# EAGLE design PhotoSensor (EAGLE 7.5.0)
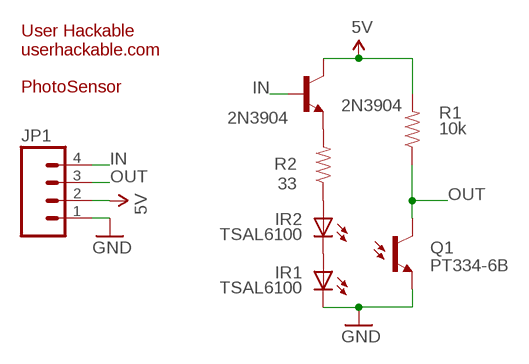
[diagram p0: schematic, sheet 1]

## Parts
2N3904  2N3904  TRANSISTOR_NPNTO-92-AMMO  [TO-92-AMMO]
IR1  TSAL6100  LED5MM  [LED5MM]
IR2  TSAL6100  LED5MM  [LED5MM]
JP1  M04PTH  [1X04]
Q1  PT334-6B  PHOTOTRANSISTOR5MM  [LED5MM]
R1  10k  RESISTORAXIAL-0.3  [AXIAL-0.3]
R2  33  RESISTORAXIAL-0.3  [AXIAL-0.3]

## Nets
5V: 2N3904.3(C) JP1.2 R1.P$2
GND: IR1.K(C) JP1.1 Q1.A(E)
IN: 2N3904.2(B) JP1.4
N$1: IR1.A IR2.K(C)
N$3: IR2.A R2.P$1
N$4: 2N3904.1(E) R2.P$2
OUT: JP1.3 Q1.K(C) R1.P$1

## Notes on the sheet
- User Hackable
  userhackable.com
  
  PhotoSensor

## Library data of the parts
2N3904 = barbary_enterprises:TRANSISTOR_NPN: Generic NPN BJT MMBT2222A - TRANS-08049 (SOT-23, 1A 40V) MPSA42 - TRANS-09116 (SOT-23, 500mA 300V) MMBT5088LT1G - TRANS-11160 (SOT-23, 50 mA 30V)
IR1 IR2 = Optics:LED: LEDs Standard schematic elements and footprints for 5mm, 3mm, 1206, and 0603 sized LEDs. 5mm - Spark Fun Electronics SKU : COM-00529 (and others)
JP1 = barbary_enterprises:M04: Header 4 Standard 4-pin 0.1" header. Use with straight break away headers (SKU : PRT-00116), right angle break away headers (PRT-00553), swiss pins (PRT-00743), machine pins (PRT-00117), and female headers (PRT-00115). Molex polarized connector foot print use with SKU : PRT-08231 with associated crimp pins and housings. 1MM SMD Version SKU: PRT-10208
Q1 = Optics:PHOTOTRANSISTOR
R1 R2 = barbary_enterprises:RESISTOR: Resistor Basic schematic elements and footprints for 0603, 1206, and PTH resistors.

## Board
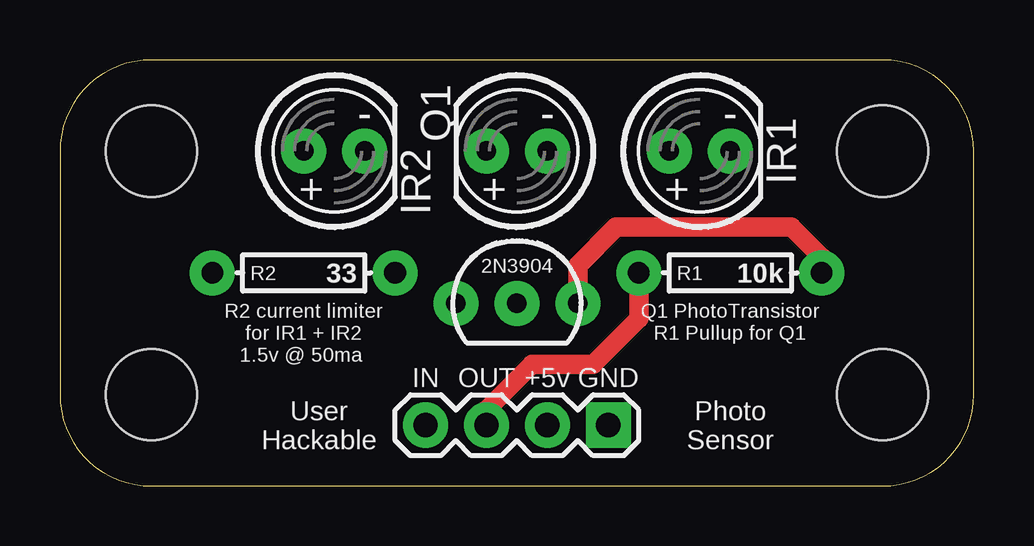
[diagram p1: board, top side]
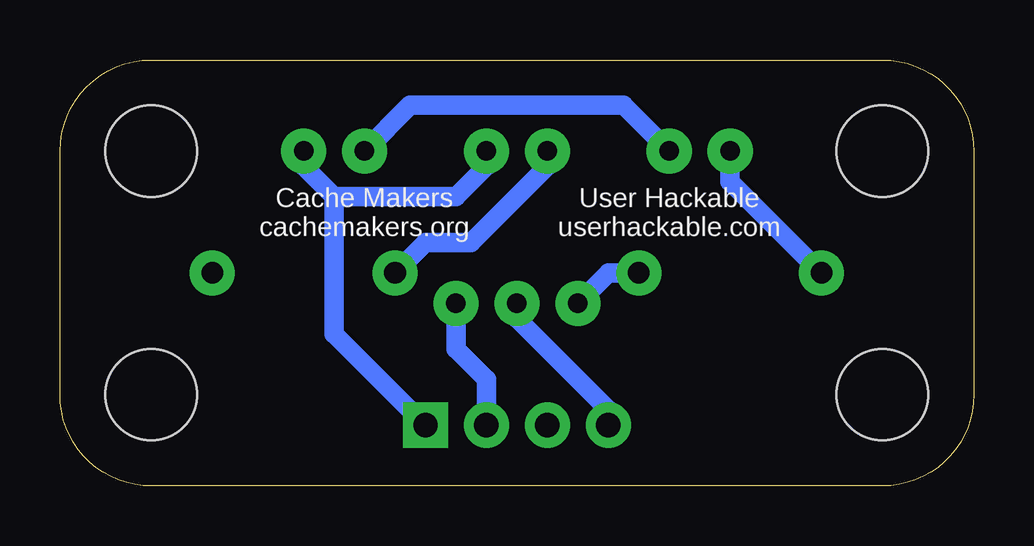
[diagram p2: board, bottom side, seen from below]

Size 38.1 x 17.77 mm. Coordinates in mm from the lower left corner, seen from the top.
Outline: 0,13.96 0,3.81 arc90 3.81,0 34.29,0 arc90 38.1,3.81 38.09,13.98 arc90 34.29,17.77 3.81,17.77 arc90 0,13.96
Copper layers (1*16): Top 0.0356mm / dielectric 1.5011mm / Bottom 0.0356mm
Design rules "LaenPCBOrder": minimum track width 6mil, minimum drill 13mil, track to track 6mil, track to pad 6mil, pad to pad 6mil, via to via 6mil, smd to smd 6mil, copper to edge 15mil, drill to drill 6mil, minimum pad ring 7mil, minimum via ring 7mil, stop-mask expansion 3mil, vias tented up to drill 0mil, thermal gap 10mil
Holes 3.81 mm at 3.81,3.81 34.29,3.81 3.81,13.97 34.29,13.97

### Footprints (pad centres in the part's own frame; a part is rotated, then mirrored left to right if it is on the bottom)
TO-92-AMMO = drill 0.813 pad 1.88: 1 -2.54,0; 2 0,0; 3 2.54,0
LED5MM = drill 0.813 pad 1.88: A -1.27,0; K 1.27,0
1X04 = drill 1.016 pad 1.88 square: 1 0,0 | drill 1.016 pad 1.88: 2 2.54,0; 3 5.08,0; 4 7.62,0
AXIAL-0.3 = drill 0.9 pad 1.88: P$1 -3.81,0; P$2 3.81,0

### Placement (x,y rotation side)
2N3904  19.05,7.62 0 top
IR1  26.67,13.97 0 top
IR2  11.43,13.97 0 top
JP1  22.86,2.54 180 top
Q1  19.05,13.97 180 top
R1  27.94,8.89 0 top
R2  10.16,8.89 0 top

### Tracks (layer width: path | path; a pad name or v marks a point on that pad's centre or on a via)
5V
  Top 0.813: R1.P$2 31.75,9.53 30.48,10.79 23.18,10.79 21.59,9.21 2N3904.3
  Bottom 0.813: JP1.2 20.32,4.45 21.59,5.71 2N3904.3
GND
  Bottom 0.813: IR1.K 27.94,13.34 26.67,12.06 | 26.67,12.06 21.59,12.06 20.32,13.34 Q1.A | JP1.1 26.67,6.35 26.67,12.06
IN
  Bottom 0.813: 2N3904.2 19.05,6.99 15.24,3.17 JP1.4
N$1
  Bottom 0.813: IR2.K 14.61,15.88 23.5,15.88 IR1.A
N$3
  Bottom 0.813: IR2.A 10.16,12.7 R2.P$1
N$4
  Bottom 0.813: R2.P$2 15.24,8.89 2N3904.1
OUT
  Top 0.813: JP1.3 17.78,3.17 19.68,5.08 22.23,5.08 24.13,6.99 R1.P$1
  Bottom 0.813: R1.P$1 22.86,10.16 20.95,10.16 17.78,13.34 Q1.K

### Text on the board
tPlace: - | - | - | + | + | + | R2 current limiter / for IR1 + IR2 / 1.5v @ 50ma | Q1 PhotoTransistor / R1 Pullup for Q1 | IN | OUT | +5v | GND | User / Hackable | Photo / Sensor
bPlace: User Hackable / userhackable.com | Cache Makers / cachemakers.org